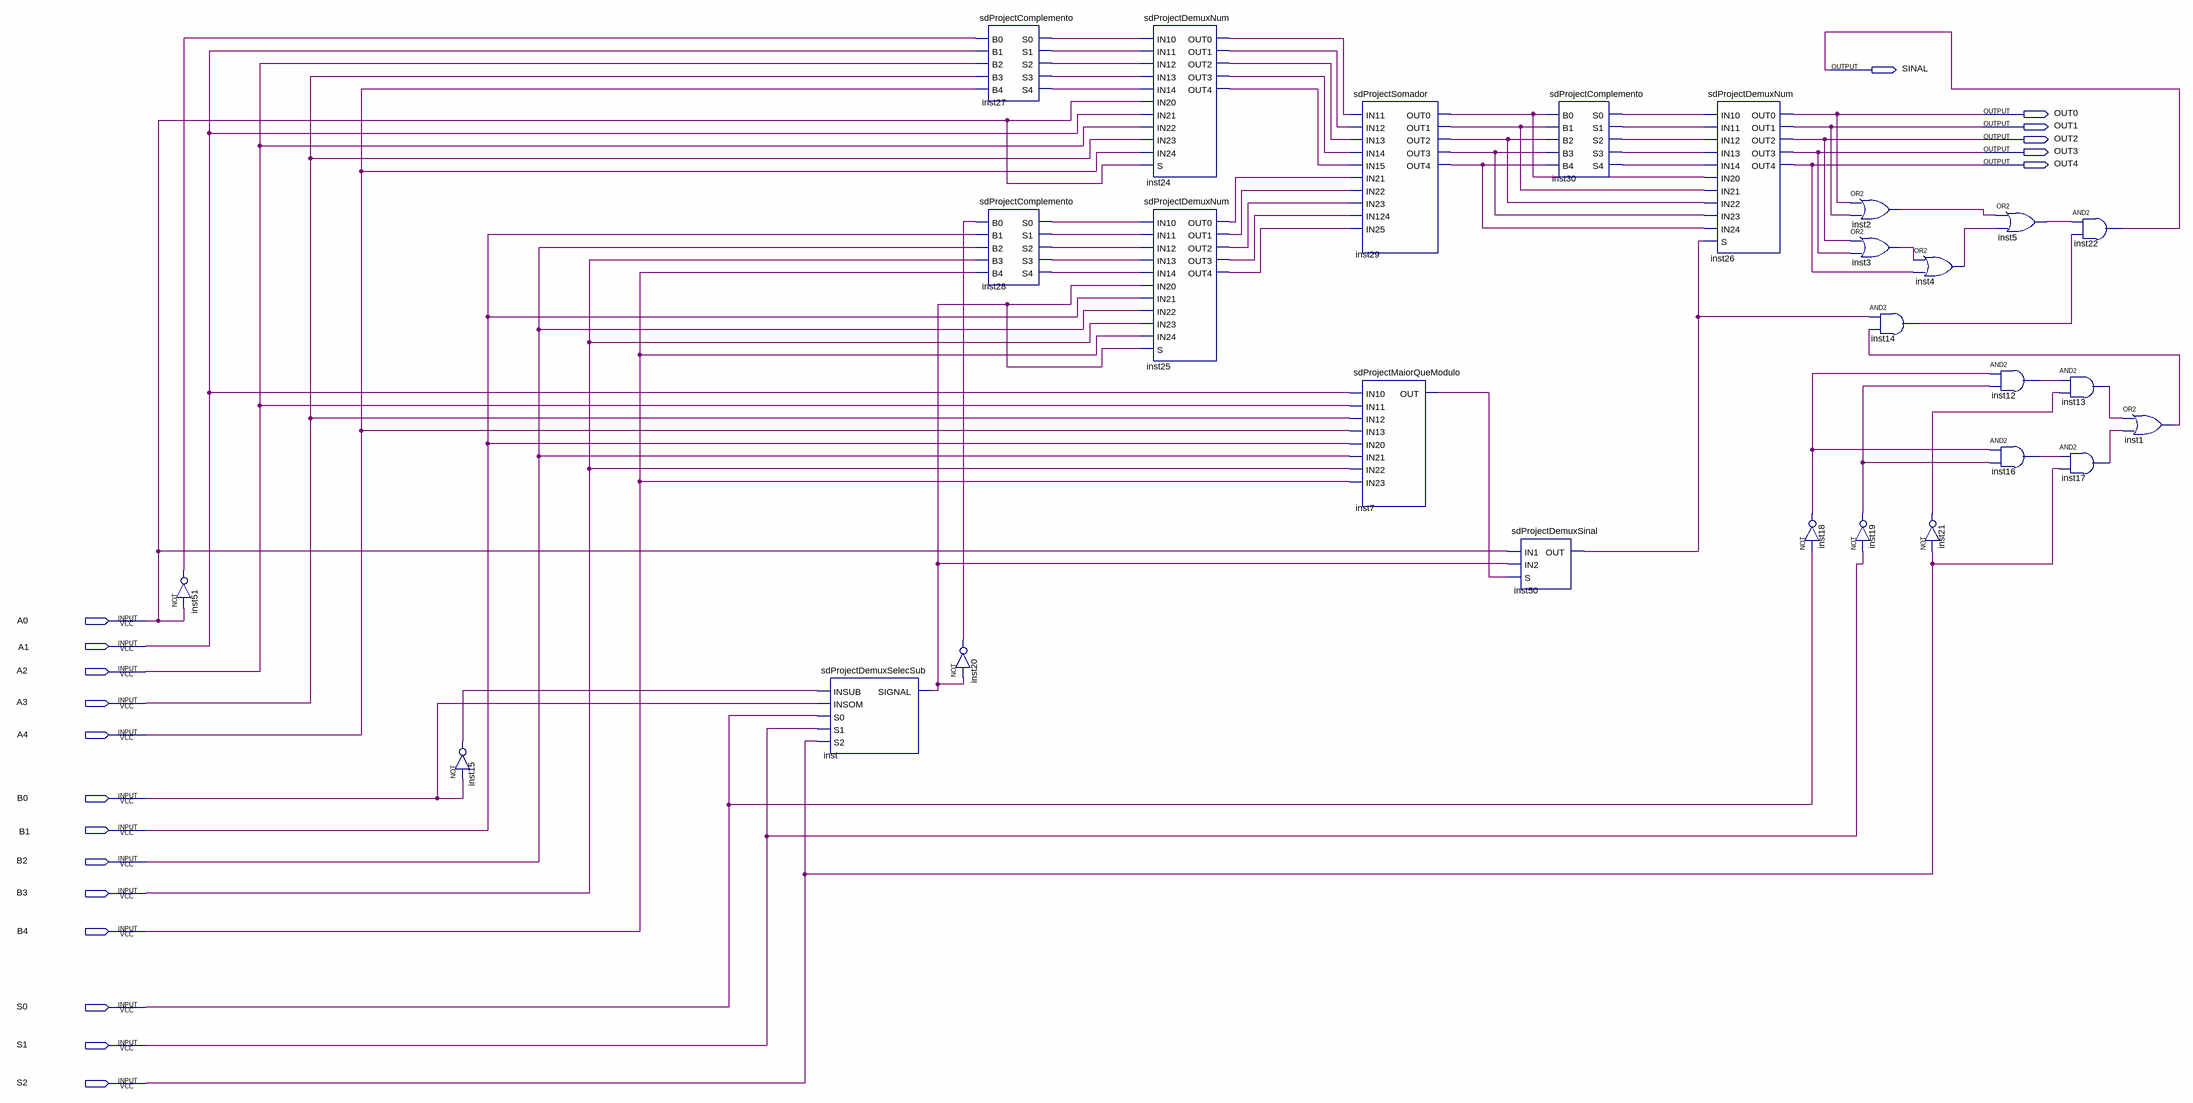
[diagram p0: schematic sheet]
// Quartus schematic sdProjectSomadorESubtrator.bdf as structural Verilog: 27 symbols, 19 pins
module sdProjectSomadorESubtrator (
  input  A0,
  input  A1,
  input  A2,
  input  A3,
  input  A4,
  input  B0,
  input  B1,
  input  B2,
  input  B3,
  input  B4,
  input  S0,
  input  S1,
  input  S2,
  output SINAL,
  output OUT0,
  output OUT1,
  output OUT2,
  output OUT3,
  output OUT4
);

  wire inst1_out, inst2_out, inst3_out, inst4_out, inst5_out, inst7_out, inst12_out, inst13_out, inst14_out,
       inst15_out, inst16_out, inst17_out, inst18_out, inst19_out, inst20_out, inst21_out, inst24_out0,
       inst24_out1, inst24_out2, inst24_out3, inst24_out4, inst25_out0, inst25_out1, inst25_out2,
       inst25_out3, inst25_out4, inst27_s0, inst27_s1, inst27_s2, inst27_s3, inst27_s4, inst28_s0, inst28_s1,
       inst28_s2, inst28_s3, inst28_s4, inst29_out0, inst29_out1, inst29_out2, inst29_out3, inst29_out4,
       inst30_s0, inst30_s1, inst30_s2, inst30_s3, inst30_s4, inst50_out, inst51_out, inst_signal;

  not inst51 (inst51_out, A0);
  not inst15 (inst15_out, B0);
  sdProjectDemuxSelecSub inst (.INSUB(inst15_out), .INSOM(B0), .S0(S0), .S1(S1), .S2(S2), .SIGNAL(inst_signal));
  sdProjectComplemento inst27 (
    .B0(inst51_out), .B1(A1), .B2(A2), .B3(A3), .B4(A4), .S0(inst27_s0), .S1(inst27_s1), .S2(inst27_s2),
    .S3(inst27_s3), .S4(inst27_s4));
  sdProjectComplemento inst28 (
    .B0(inst20_out), .B1(B1), .B2(B2), .B3(B3), .B4(B4), .S0(inst28_s0), .S1(inst28_s1), .S2(inst28_s2),
    .S3(inst28_s3), .S4(inst28_s4));
  not inst20 (inst20_out, inst_signal);
  sdProjectDemuxNum inst24 (
    .IN10(inst27_s0), .IN11(inst27_s1), .IN12(inst27_s2), .IN13(inst27_s3), .IN14(inst27_s4), .IN20(A0),
    .IN21(A1), .IN22(A2), .IN23(A3), .IN24(A4), .S(A0), .OUT0(inst24_out0), .OUT1(inst24_out1),
    .OUT2(inst24_out2), .OUT3(inst24_out3), .OUT4(inst24_out4));
  sdProjectDemuxNum inst25 (
    .IN10(inst28_s0), .IN11(inst28_s1), .IN12(inst28_s2), .IN13(inst28_s3), .IN14(inst28_s4),
    .IN20(inst_signal), .IN21(B1), .IN22(B2), .IN23(B3), .IN24(B4), .S(inst_signal), .OUT0(inst25_out0),
    .OUT1(inst25_out1), .OUT2(inst25_out2), .OUT3(inst25_out3), .OUT4(inst25_out4));
  sdProjectSomador inst29 (
    .IN11(inst24_out0), .IN12(inst24_out1), .IN13(inst24_out2), .IN14(inst24_out3), .IN15(inst24_out4),
    .IN21(inst25_out0), .IN22(inst25_out1), .IN23(inst25_out2), .IN124(inst25_out3), .IN25(inst25_out4),
    .OUT0(inst29_out0), .OUT1(inst29_out1), .OUT2(inst29_out2), .OUT3(inst29_out3), .OUT4(inst29_out4));
  sdProjectMaiorQueModulo inst7 (
    .IN10(A1), .IN11(A2), .IN12(A3), .IN13(A4), .IN20(B1), .IN21(B2), .IN22(B3), .IN23(B4), .OUT(inst7_out));
  sdProjectComplemento inst30 (
    .B0(inst29_out0), .B1(inst29_out1), .B2(inst29_out2), .B3(inst29_out3), .B4(inst29_out4), .S0(inst30_s0),
    .S1(inst30_s1), .S2(inst30_s2), .S3(inst30_s3), .S4(inst30_s4));
  sdProjectDemuxSinal inst50 (.IN1(A0), .IN2(inst_signal), .S(inst7_out), .OUT(inst50_out));
  sdProjectDemuxNum inst26 (
    .IN10(inst30_s0), .IN11(inst30_s1), .IN12(inst30_s2), .IN13(inst30_s3), .IN14(inst30_s4),
    .IN20(inst29_out0), .IN21(inst29_out1), .IN22(inst29_out2), .IN23(inst29_out3), .IN24(inst29_out4),
    .S(inst50_out), .OUT0(OUT0), .OUT1(OUT1), .OUT2(OUT2), .OUT3(OUT3), .OUT4(OUT4));
  not inst18 (inst18_out, S0);
  or inst2 (inst2_out, OUT0, OUT1);
  or inst3 (inst3_out, OUT2, OUT3);
  not inst19 (inst19_out, S1);
  and inst14 (inst14_out, inst50_out, inst1_out);
  or inst4 (inst4_out, inst3_out, OUT4);
  not inst21 (inst21_out, S2);
  or inst5 (inst5_out, inst2_out, inst4_out);
  and inst12 (inst12_out, inst18_out, inst19_out);
  and inst16 (inst16_out, inst18_out, inst19_out);
  and inst22 (SINAL, inst5_out, inst14_out);
  and inst13 (inst13_out, inst12_out, inst21_out);
  and inst17 (inst17_out, inst16_out, S2);
  or inst1 (inst1_out, inst13_out, inst17_out);
endmodule
